# Altium schematic sheet QMC5883P1_QMC5883P.schdoc
size 124 x 99 mm
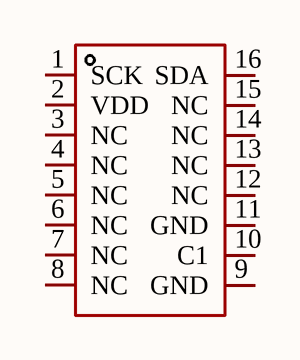
[diagram p0: QMC5883P1_QMC5883P.schdoc]

## Parts
U?  QMC5883P  [LGA-16_L3.0-W3.0-P0.50-BL_SQ]  (value not drawn)

## Nets

Not connected (* = marked no-connect by the designer): U? 1(SCK) 2(VDD) 3(NC) 4(NC) 5(NC) 6(NC) 7(NC) 8(NC) 9(GND) 10(C1) 11(GND) 12(NC) 13(NC) 14(NC) 15(NC) 16(SDA)

## Library data of the parts
U? = QMC5883P: Manufacturer: QST(上海矽睿); Add into BOM: yes; Symbol: QMC5883P; Device: QMC5883P; LCSC Part Name: 三轴磁传感器; Supplier Part: C2847467; Manufacturer Part: QMC5883P; Supplier Footprint: LGA-16(3x3); JLCPCB Part Class: Extended Part; Datasheet: https://item.szlcsc.com/datasheet/QMC5883P/3044607.html; Supplier: LCSC; Convert to PCB: yes